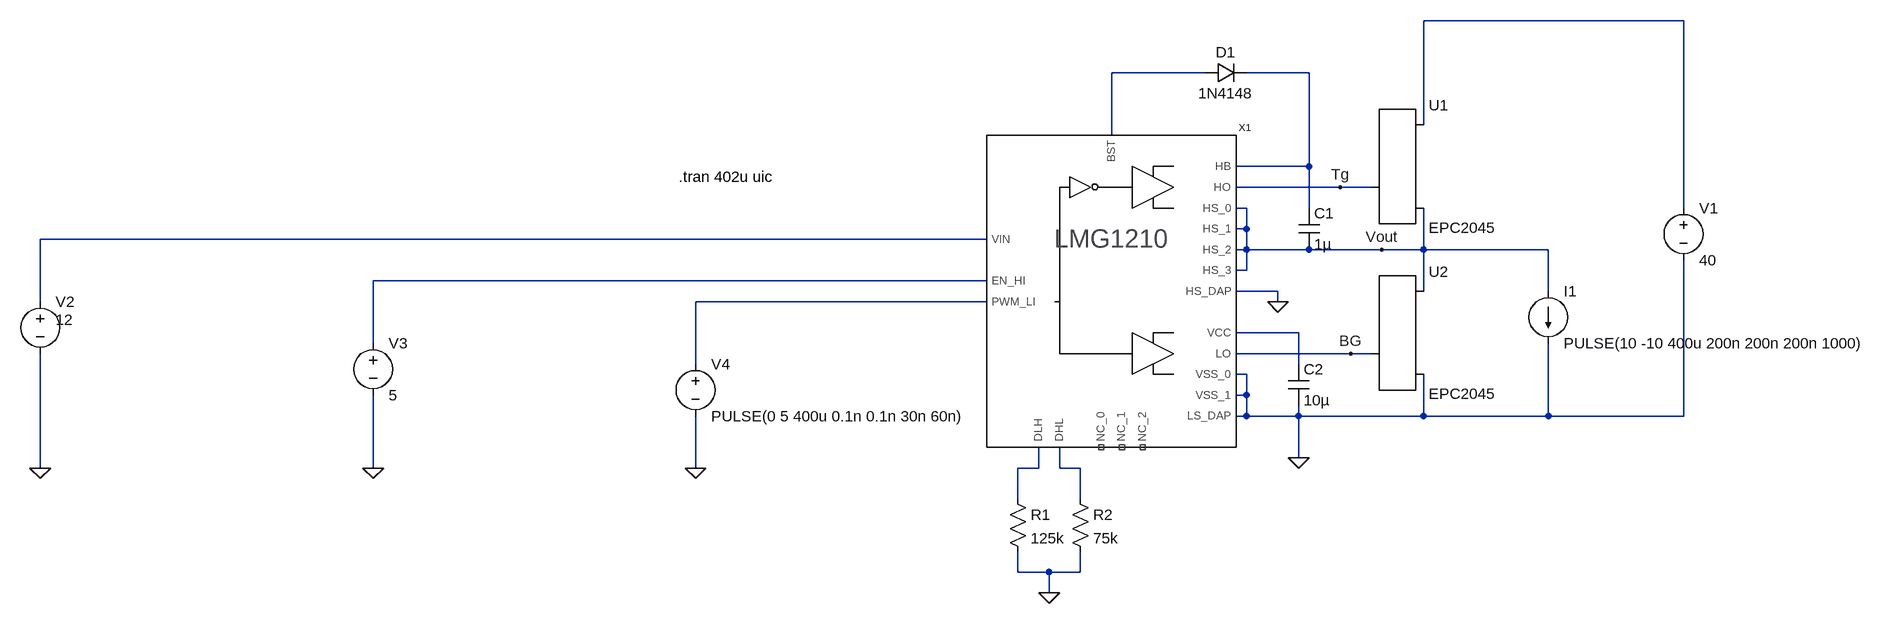
[diagram p0: schematic LMG1210 test circuit.asc]
LMG1210 test circuit.asc, the LTspice schematic file:
Version 4
SHEET 1 1692 724
WIRE 1376 -320 976 -320
WIRE 640 -240 496 -240
WIRE 800 -240 704 -240
WIRE 976 -160 976 -320
WIRE 496 -144 496 -240
WIRE 800 -96 800 -240
WIRE 800 -96 688 -96
WIRE 848 -64 688 -64
WIRE 896 -64 848 -64
WIRE 704 -32 688 -32
WIRE 800 -32 800 -96
WIRE 1376 -32 1376 -320
WIRE 704 0 704 -32
WIRE 704 0 688 0
WIRE 304 16 -1152 16
WIRE 704 32 704 0
WIRE 704 32 688 32
WIRE 800 32 704 32
WIRE 912 32 800 32
WIRE 976 32 976 -32
WIRE 976 32 912 32
WIRE 1168 32 976 32
WIRE 704 64 704 32
WIRE 704 64 688 64
WIRE 304 80 -640 80
WIRE 752 96 688 96
WIRE 976 96 976 32
WIRE 1168 96 1168 32
WIRE -1152 112 -1152 16
WIRE 304 112 -144 112
WIRE 752 112 752 96
WIRE 784 160 688 160
WIRE -640 176 -640 80
WIRE 864 192 688 192
WIRE 896 192 864 192
WIRE -144 208 -144 112
WIRE 784 208 784 160
WIRE 704 224 688 224
WIRE 704 256 704 224
WIRE 704 256 688 256
WIRE 704 288 704 256
WIRE 704 288 688 288
WIRE 784 288 784 272
WIRE 784 288 704 288
WIRE 976 288 976 224
WIRE 976 288 784 288
WIRE 1168 288 1168 176
WIRE 1168 288 976 288
WIRE 1376 288 1376 48
WIRE 1376 288 1168 288
WIRE 784 352 784 288
WIRE -1152 368 -1152 192
WIRE -640 368 -640 256
WIRE -144 368 -144 288
WIRE 384 368 384 336
WIRE 384 368 352 368
WIRE 416 368 416 336
WIRE 448 368 416 368
WIRE 352 416 352 368
WIRE 448 416 448 368
WIRE 352 528 352 496
WIRE 400 528 352 528
WIRE 448 528 448 496
WIRE 448 528 400 528
WIRE 400 560 400 528
FLAG 784 352 0
FLAG -1152 368 0
FLAG 400 560 0
FLAG -640 368 0
FLAG -144 368 0
FLAG 752 112 0
FLAG 848 -64 Tg
FLAG 864 192 BG
FLAG 912 32 Vout
SYMBOL EPCGaN 896 -64 R0
SYMATTR InstName U1
SYMATTR Value EPC2045
SYMBOL diode 640 -224 R270
WINDOW 0 32 32 VTop 2
WINDOW 3 0 32 VBottom 2
SYMATTR InstName D1
SYMATTR Value 1N4148
SYMBOL cap 784 -32 R0
SYMATTR InstName C1
SYMATTR Value 1µ
SYMBOL EPCGaN 896 192 R0
SYMATTR InstName U2
SYMATTR Value EPC2045
SYMBOL cap 768 208 R0
SYMATTR InstName C2
SYMATTR Value 10µ
SYMBOL voltage 1376 -48 R0
WINDOW 123 0 0 Left 0
WINDOW 39 0 0 Left 0
SYMATTR InstName V1
SYMATTR Value 40
SYMBOL voltage -1152 96 R0
WINDOW 3 24 44 Left 2
WINDOW 123 0 0 Left 0
WINDOW 39 0 0 Left 0
SYMATTR InstName V2
SYMATTR Value 12
SYMBOL res 336 400 R0
SYMATTR InstName R1
SYMATTR Value 125k
SYMBOL res 432 400 R0
SYMATTR InstName R2
SYMATTR Value 75k
SYMBOL voltage -640 160 R0
WINDOW 123 0 0 Left 0
WINDOW 39 0 0 Left 0
SYMATTR InstName V3
SYMATTR Value 5
SYMBOL voltage -144 192 R0
WINDOW 123 0 0 Left 0
WINDOW 39 0 0 Left 0
SYMATTR InstName V4
SYMATTR Value PULSE(0 5 400u 0.1n 0.1n 30n 60n)
SYMBOL LMG1210 496 -64 R0
SYMATTR InstName X1
SYMATTR Prefix ""
SYMBOL current 1168 96 R0
WINDOW 123 0 0 Left 0
WINDOW 39 0 0 Left 0
SYMATTR InstName I1
SYMATTR Value PULSE(10 -10 400u 200n 200n 200n 1000)
TEXT -170 -80 Left 2 !.tran 402u uic

The netlist it stands for:
* LMG1210 test circuit.asc
XU1 Tg N001 Vout EPC2045
D1 N002 N003 1N4148
C1 N003 Vout 1µ
XU2 BG Vout 0 EPC2045
C2 N007 0 10µ
V1 N001 0 40
V2 N004 0 12
R1 N008 0 125k
R2 N009 0 75k
V3 N005 0 5
V4 N006 0 PULSE(0 5 400u 0.1n 0.1n 30n 60n)
XX1 N003 Tg N006 Vout Vout Vout Vout 0 0 N004 BG N009 N008 N007 0 0 N005 NC_01 NC_02 NC_03 N002 LMG1210  ; pins HB HO PWM_LI HS_0 HS_1 HS_2 HS_3 HS_DAP LS_DAP VIN LO DHL DLH VCC VSS_0 VSS_1 EN_HI NC_0 NC_1 NC_2 BST
I1 Vout 0 PULSE(10 -10 400u 200n 200n 200n 1000)
.model D D
.lib standard.dio
.tran 402u uic
.lib LMG1210_TRANS.lib
.backanno
.end